# Altium schematic sheet Channels [1,2].SchDoc
size A4; DocumentNumber: 3; SheetNumber: 3; SheetTotal: 11
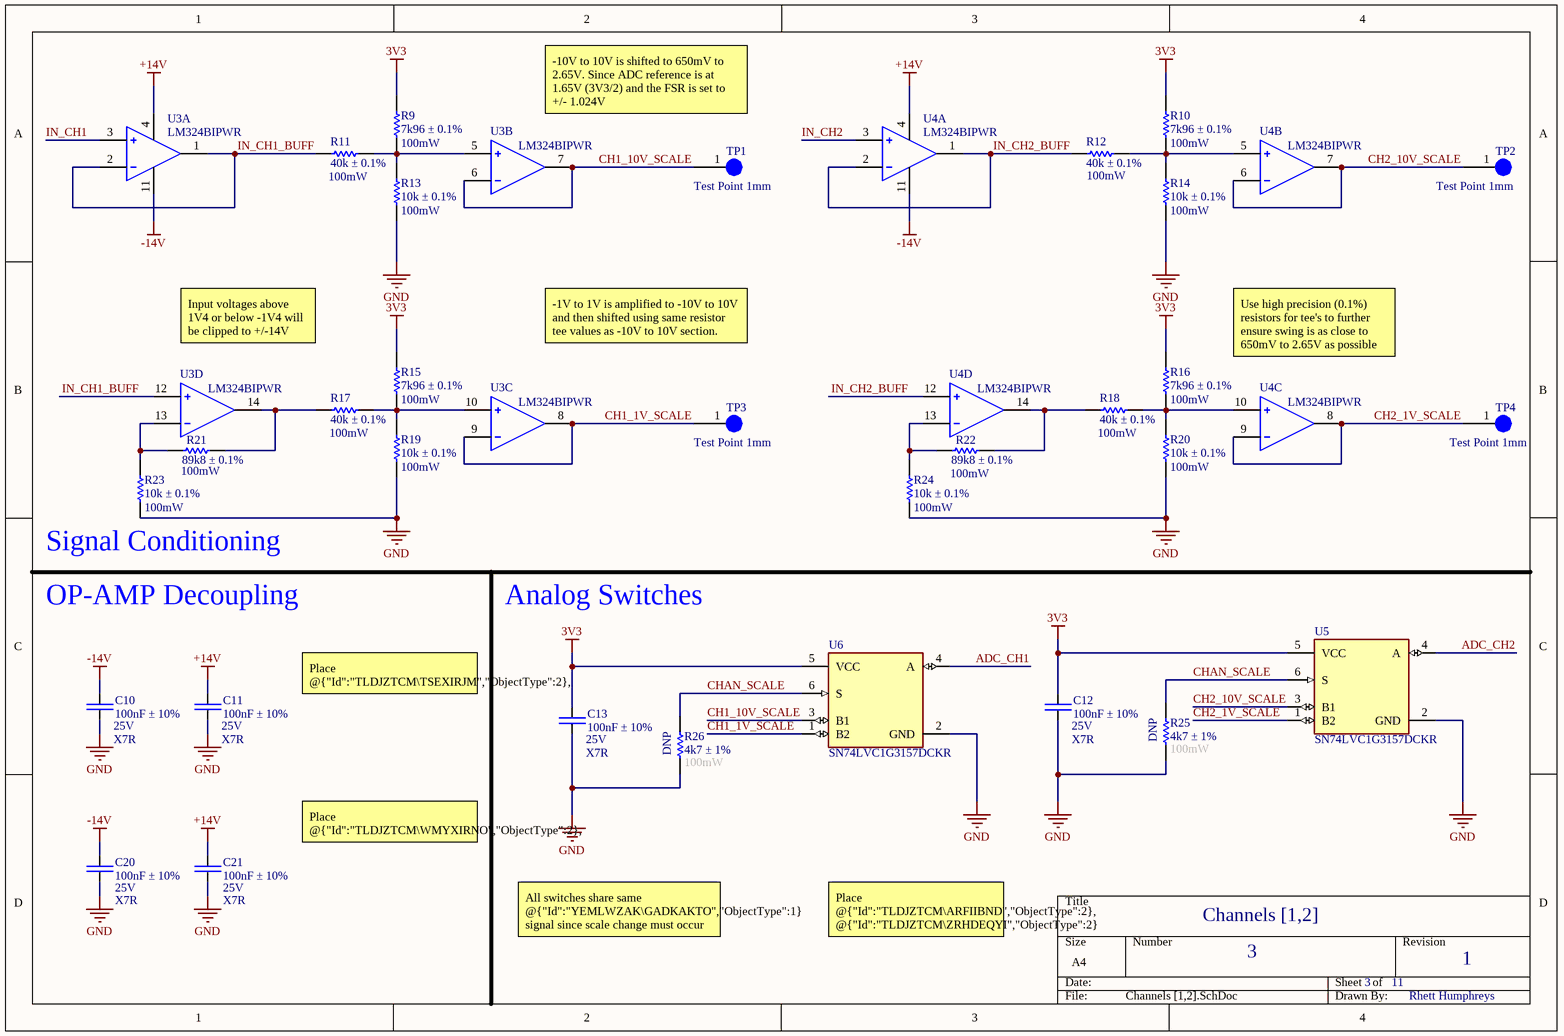
[diagram p0: Channels [1,2].SchDoc]

## Parts
C10  100nF ± 10%  [CAP-0603]
C11  100nF ± 10%  [CAP-0603]
C12  100nF ± 10%  [CAP-0603]
C13  100nF ± 10%  [CAP-0603]
C20  100nF ± 10%  [CAP-0603]
C21  100nF ± 10%  [CAP-0603]
R9  7k96 ± 0.1%  [RES-0603]
R10  7k96 ± 0.1%  [RES-0603]
R11  40k ± 0.1%  [RES-0603]
R12  40k ± 0.1%  [RES-0603]
R13  10k ± 0.1%  [RES-0603]
R14  10k ± 0.1%  [RES-0603]
R15  7k96 ± 0.1%  [RES-0603]
R16  7k96 ± 0.1%  [RES-0603]
R17  40k ± 0.1%  [RES-0603]
R18  40k ± 0.1%  [RES-0603]
R19  10k ± 0.1%  [RES-0603]
R20  10k ± 0.1%  [RES-0603]
R21  89k8 ± 0.1%  [RES-0603]
R22  89k8 ± 0.1%  [RES-0603]
R23  10k ± 0.1%  [RES-0603]
R24  10k ± 0.1%  [RES-0603]
R25  4k7 ± 1%  [RES-0603]
R26  4k7 ± 1%  [RES-0603]
TP1  Test Point 1mm  [Test Point 1mm]
TP2  Test Point 1mm  [Test Point 1mm]
TP3  Test Point 1mm  [Test Point 1mm]
TP4  Test Point 1mm  [Test Point 1mm]
U3  LM324BIPWR  [FP-PW0014A-MFG]  (parts A,B,C,D of 4)
U4  LM324BIPWR  [FP-PW0014A-MFG]  (parts A,B,C,D of 4)
U5  SN74LVC1G3157DCKR  [FP-DCK0006A-IPC_B]
U6  SN74LVC1G3157DCKR  [FP-DCK0006A-IPC_B]

## Nets
3V3: C12.2 C13.2 R9.1 R10.1 R15.1 R16.1 U5.5(VCC) U6.5(VCC)
+14V: C11.2 C21.2 U3.4(VCC+) U4.4(VCC+)
-14V: C10.2 C20.2 U3.11(VCC-) U4.11(VCC-)
GND: C10.1 C11.1 C12.1 C13.1 C20.1 C21.1 R13.2 R14.2 R19.2 R20.2 R23.2 R24.2 R25.2 R26.2 U5.2(GND) U6.2(GND)
ADC_CH1: U6.4(A)
ADC_CH2: U5.4(A)
CH1_1V_SCALE: TP3.1 U3.8(3OUT) U3.9(3IN-) U6.1(B2)
CH1_10V_SCALE: TP1.1 U3.6(2IN-) U3.7(2OUT) U6.3(B1)
CH2_1V_SCALE: TP4.1 U4.8(3OUT) U4.9(3IN-) U5.1(B2)
CH2_10V_SCALE: TP2.1 U4.6(2IN-) U4.7(2OUT) U5.3(B1)
CHAN_SCALE: R25.1 R26.1 U5.6(S) U6.6(S)
IN_CH1: U3.3(1IN+)
IN_CH1_BUFF: R11.2 U3.1(1OUT) U3.2(1IN-) U3.12(4IN+)
IN_CH2: U4.3(1IN+)
IN_CH2_BUFF: R12.2 U4.1(1OUT) U4.2(1IN-) U4.12(4IN+)
NetR9_2: R9.2 R11.1 R13.1 U3.5(2IN+)
NetR10_2: R10.2 R12.1 R14.1 U4.5(2IN+)
NetR15_2: R15.2 R17.1 R19.1 U3.10(3IN+)
NetR16_2: R16.2 R18.1 R20.1 U4.10(3IN+)
NetR17_2: R17.2 R21.1 U3.14(4OUT)
NetR18_2: R18.2 R22.1 U4.14(4OUT)
NetR21_2: R21.2 R23.1 U3.13(4IN-)
NetR22_2: R22.2 R24.1 U4.13(4IN-)

## Notes on the sheet
- -10V to 10V is shifted to 650mV to 2.65V. Since ADC reference is at 1.65V (3V3/2) and the FSR is set to +/- 1.024V
- (near R11) 100mW
- (near R9) 100mW
- (near R12) 100mW
- (near R10) 100mW
- (near R13) 100mW
- (near R14) 100mW
- Input voltages above 1V4 or below -1V4 will be clipped to +/-14V
- -1V to 1V is amplified to -10V to 10V and then shifted using same resistor tee values as -10V to 10V section.
- Use high precision (0.1%) resistors for tee's to further ensure swing is as close to 650mV to 2.65V as possible
- (near R17) 100mW
- (near R15) 100mW
- (near R18) 100mW
- (near R16) 100mW
- (near R23) 100mW
- (near R21) 100mW
- (near R19) 100mW
- (near R24) 100mW
- (near R22) 100mW
- (near R20) 100mW
- (near R23) Signal Conditioning
- OP-AMP Decoupling
- Analog Switches
- Place @{"Id":"TLDJZTCM\TSEXIRJM","ObjectType":2}, @{"Id":"TLDJZTCM\LSKHBFHO","ObjectType":2} as close as possible to @{"Id":"TLDJZTCM\QXNYIEIL","ObjectType":2}
- (near C10) X7R
- (near C10) 25V
- (near C11) X7R
- (near C11) 25V
- (near C13) X7R
- (near C13) 25V
- (near R26) DNP
- (near R26) 100mW
- (near C12) X7R
- (near C12) 25V
- (near R25) DNP
- (near R25) 100mW
- Place @{"Id":"TLDJZTCM\WMYXIRNO","ObjectType":2}, @{"Id":"TLDJZTCM\EVSPQWQB","ObjectType":2} as close as possible to @{"Id":"TLDJZTCM\DEGCNGJX","ObjectType":2}
- (near C20) X7R
- (near C20) 25V
- (near C21) X7R
- (near C21) 25V
- Channels [1,2]
- All switches share same @{"Id":"YEMLWZAK\GADKAKTO","ObjectType":1} signal since scale change must occur on all channels.
- Place @{"Id":"TLDJZTCM\ARFIIBND","ObjectType":2}, @{"Id":"TLDJZTCM\ZRHDEQYI","ObjectType":2} as close as possible to @{"Id":"TLDJZTCM\ILIOHQVR","ObjectType":2}, @{"Id":"TLDJZTCM\NPQFYXBL","ObjectType":2} respectively.
- 3
- 11
- 1
- Rhett Humphreys

## Library data of the parts
C10-C13 C20 C21 = CAP-0603: Capacitor chip unpolarized. 0603
R9-R26 = RES-0603: Resistor chip. 0603
U3 U4 = CMP-00370-131314463-1: LM324BIPWR Quad, 36-V, 1.2-MHz 3-mV offset voltage operational amplifier 14-TSSOP -40 to 85; Manufacturer Lifecycle Status: ACTIVE; Number of Pins: 14; NexarPartId: 131314463; Height: 1.2mm; Thickness: 1mm; Length: 5mm; Lifecycle Status: Production; Width: 4.4mm; Case/Package: TSSOP
U5 U6 = CMP-0859-00516-4: IC SWITCH SPDT SC70-6; Nominal Supply Current: 10uA; Number of Inputs: 1; Supply Type: Single; Operating Supply Current: 1uA; Polarity: Non-Inverting; Low Level Output Current: 128mA; Bandwidth: 300MHz; Max Supply Voltage: 5.5V; Turn-Off Delay Time: 3.8ns; Turn-On Delay Time: 5.7ns; Number of Outputs: 2; Min Supply Voltage: 1.65V; Propagation Delay: 300ps; On-State Resistance: 15R; Mount: Surface Mount; Throw Configuration: SPDT; Min Operating Temperature: -40°C; Radiation Hardening: No; Number of Pins: 6; Case/Package: SC; Length: 2mm; Lead Free: Lead Free; REACH SVHC: No SVHC; Termination: SMD/SMT; High Level Output Current: 128mA; Height: 0.9mm; Weight: 8.8E-05oz; Package Quantity: 3000; Number of Channels: 1; Packaging: Tape and Reel; Number of Bits: 1; Width: 1.25mm; Max Operating Temperature: 125°C; Max Supply Current: 10uA; Contact Plating: Gold; RoHS Compliant: Yes